# Altium project MotorControllerProject.PrjPCB
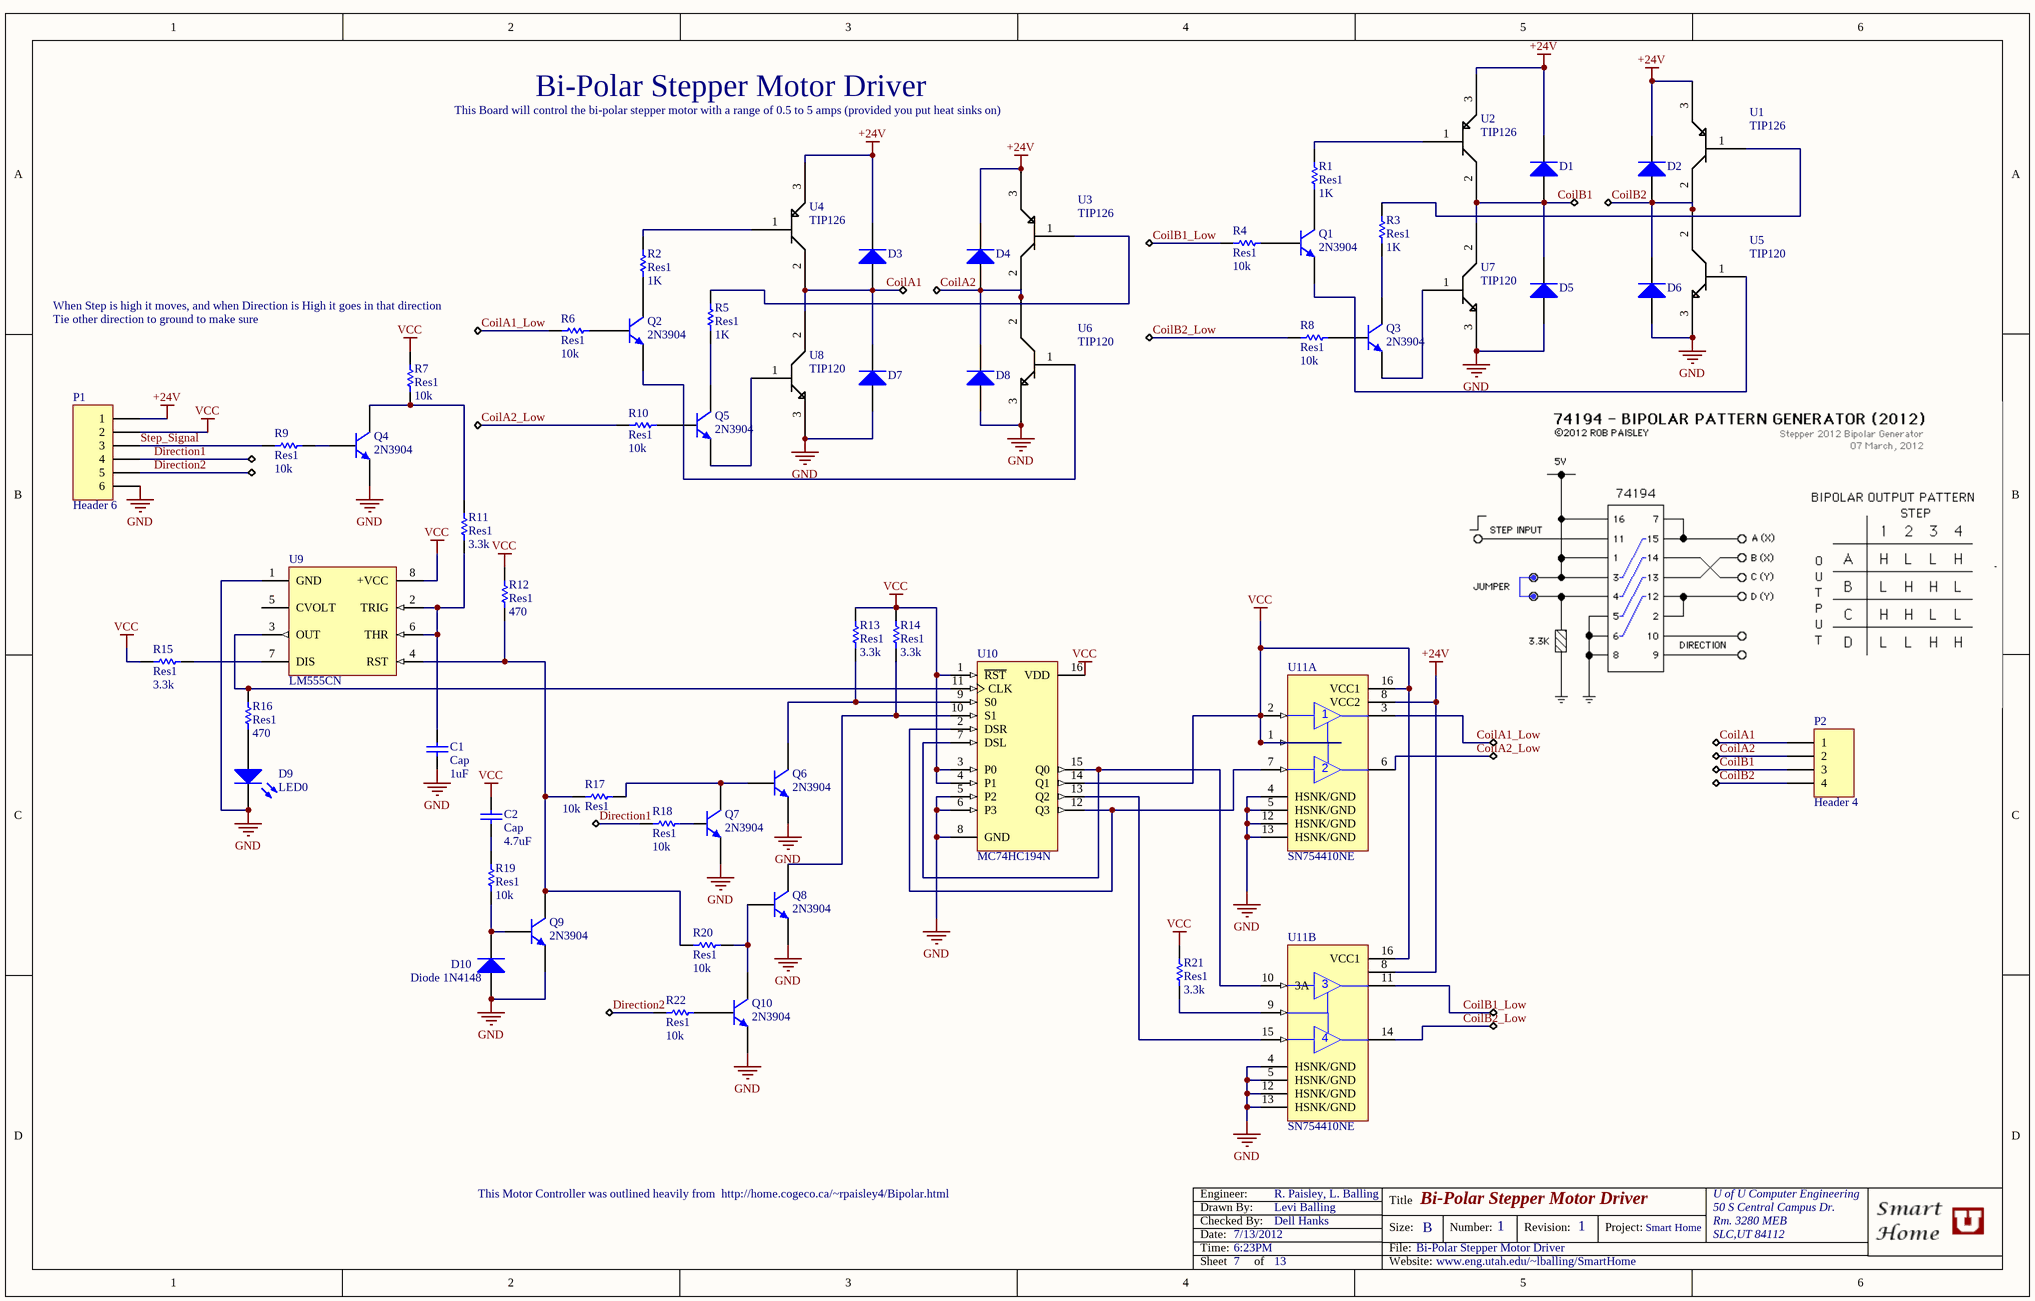
[diagram p0: MotorController.SchDoc]
1 sheet, 57 parts. Net scope: global (net labels, ports and power ports of the same name join across sheets).
Board file: HighPowerMotorController.PcbDoc

## Sheet MotorController.SchDoc: Bi-Polar Stepper Motor Driver
size B; Date: 7/13/2012; ApprovedBy: Levi Balling; CheckedBy: Dell Hanks; Author: Rob Paisley; CompanyName: Smart Home; DrawnBy: Levi Balling; Engineer: R. Paisley, L. Balling; Organization: U of U Computer Engineering; Address1: 50 S Central Campus Dr.; Address2: Rm. 3280 MEB; Address3: SLC,UT 84112; DocumentNumber: 1; Revision: 1; SheetNumber: 7; SheetTotal: 13; Project: Smart Home; Website: www.eng.utah.edu/~lballing/SmartHome; Description: This Board will control the bi-polar stepper motor with a range of 0.5 to 5 amps (provided you put heat sinks on); CurrentTime: 6:23PM; CurrentDate: 7/13/2012; DocumentName: Bi-Polar Stepper Motor Driver; ProjectName: Smart Home

### Parts
C1  Cap  value 1uF  [RAD-0.3]
C2  Cap  value 4.7uF  [RAD-0.3]
D1  Diode 1N5408  [DO-201AD]  (value not drawn)
D2  Diode 1N5408  [DO-201AD]  (value not drawn)
D3  Diode 1N5408  [DO-201AD]  (value not drawn)
D4  Diode 1N5408  [DO-201AD]  (value not drawn)
D5  Diode 1N5408  [DO-201AD]  (value not drawn)
D6  Diode 1N5408  [DO-201AD]  (value not drawn)
D7  Diode 1N5408  [DO-201AD]  (value not drawn)
D8  Diode 1N5408  [DO-201AD]  (value not drawn)
D9  LED0  [LED-0]
D10  Diode 1N4148  [DO-35]
P1  Header 6  [HDR1X6]
P2  Header 4  [HDR1X4]
Q1  2N3904  [2N3904]
Q2  2N3904  [2N3904]
Q3  2N3904  [2N3904]
Q4  2N3904  [2N3904]
Q5  2N3904  [2N3904]
Q6  2N3904  [2N3904]
Q7  2N3904  [2N3904]
Q8  2N3904  [2N3904]
Q9  2N3904  [2N3904]
Q10  2N3904  [2N3904]
R1  Res1  value 1K  [AXIAL-0.3]
R2  Res1  value 1K  [AXIAL-0.3]
R3  Res1  value 1K  [AXIAL-0.3]
R4  Res1  value 10k  [AXIAL-0.3]
R5  Res1  value 1K  [AXIAL-0.3]
R6  Res1  value 10k  [AXIAL-0.3]
R7  Res1  value 10k  [AXIAL-0.3]
R8  Res1  value 10k  [AXIAL-0.3]
R9  Res1  value 10k  [AXIAL-0.3]
R10  Res1  value 10k  [AXIAL-0.3]
R11  Res1  value 3.3k  [AXIAL-0.3]
R12  Res1  value 470  [AXIAL-0.3]
R13  Res1  value 3.3k  [AXIAL-0.3]
R14  Res1  value 3.3k  [AXIAL-0.3]
R15  Res1  value 3.3k  [AXIAL-0.3]
R16  Res1  value 470  [AXIAL-0.3]
R17  Res1  value 10k  [AXIAL-0.3]
R18  Res1  value 10k  [AXIAL-0.3]
R19  Res1  value 10k  [AXIAL-0.3]
R20  Res1  value 10k  [AXIAL-0.3]
R21  Res1  value 3.3k  [AXIAL-0.3]
R22  Res1  value 10k  [AXIAL-0.3]
U1  TIP126  [TO-220]
U2  TIP126  [TO-220]
U3  TIP126  [TO-220]
U4  TIP126  [TO-220]
U5  TIP120  [TO-220]
U6  TIP120  [TO-220]
U7  TIP120  [TO-220]
U8  TIP120  [TO-220]
U9  LM555CN  [N08E]
U10  MC74HC194N  [648-06]
U11  SN754410NE  [NE016]  (parts A,B of 2)

### Nets
+24V: D1.2(K) D2.2(K) D3.2(K) D4.2(K) P1.1 U1.3 U2.3 U3.3 U4.3 U11.8(VCC2)
GND: C1.2 D5.1(A) D6.1(A) D7.1(A) D8.1(A) D9.2(K) D10.1(A) P1.6 Q4.1(E) Q6.1(E) Q7.1(E) Q8.1(E) Q9.1(E) Q10.1(E) U5.3 U6.3 U7.3 U8.3 U9.1(GND) U10.5(P2) U10.6(P3) U10.8(GND) U11.4(HSNK/GND) U11.5(HSNK/GND) U11.12(HSNK/GND) U11.13(HSNK/GND)
VCC: C2.1 P1.2 R7.2 R12.1 R13.1 R14.1 R15.2 R21.1 U9.8(+VCC) U10.1(~{RST}) U10.3(P0) U10.4(P1) U10.14(Q1) U10.16(VDD) U11.1(1,2EN) U11.2(1A) U11.16(VCC1)
CoilA1: D3.1(A) D7.2(K) P2.1 U4.2 U8.2
CoilA1_Low: R6.1 U11.3(1Y)
CoilA2: D4.1(A) D8.2(K) P2.2 U3.2 U6.2
CoilA2_Low: R10.1 U11.6(2Y)
CoilB1: D1.1(A) D5.2(K) P2.3 U2.2 U7.2
CoilB1_Low: R4.1 U11.11(3Y)
CoilB2: D2.1(A) D6.2(K) P2.4 U1.2 U5.2
CoilB2_Low: R8.1 U11.14(4Y)
Direction1: P1.4 R18.2
Direction2: P1.5 R22.2
Step_Signal: P1.3 R9.2
NetC1_1: C1.1 R11.1 U9.2(TRIG) U9.6(THR)
NetC2_2: C2.2 R19.1
NetD9_1: D9.1(A) R16.2
NetD10_2: D10.2(K) Q9.2(B) R19.2
NetQ1_1: Q1.1(E) U5.1
NetQ1_2: Q1.2(B) R4.2
NetQ1_3: Q1.3(C) R1.1
NetQ2_1: Q2.1(E) U6.1
NetQ2_2: Q2.2(B) R6.2
NetQ2_3: Q2.3(C) R2.1
NetQ3_1: Q3.1(E) U7.1
NetQ3_2: Q3.2(B) R8.2
NetQ3_3: Q3.3(C) R3.1
NetQ4_2: Q4.2(B) R9.1
NetQ4_3: Q4.3(C) R7.1 R11.2
NetQ5_1: Q5.1(E) U8.1
NetQ5_2: Q5.2(B) R10.2
NetQ5_3: Q5.3(C) R5.1
NetQ6_2: Q6.2(B) Q7.3(C) R17.2
NetQ6_3: Q6.3(C) R13.2 U10.9(S0)
NetQ7_2: Q7.2(B) R18.1
NetQ8_2: Q8.2(B) Q10.3(C) R20.2
NetQ8_3: Q8.3(C) R14.2 U10.10(S1)
NetQ9_3: Q9.3(C) R12.2 R17.1 R20.1 U9.4(RST)
NetQ10_2: Q10.2(B) R22.1
NetR1_2: R1.2 U2.1
NetR2_2: R2.2 U4.1
NetR3_2: R3.2 U1.1
NetR5_2: R5.2 U3.1
NetR15_1: R15.1 U9.7(DIS)
NetR16_1: R16.1 U9.3(OUT) U10.11(CLK)
NetR21_2: R21.2 U11.9(3,4EN)
NetU10_2: U10.2(DSR) U10.12(Q3) U11.7(2A)
NetU10_7: U10.7(DSL) U10.15(Q0) U11.10(3A)
NetU10_13: U10.13(Q2) U11.15(4A)

Not connected (* = marked no-connect by the designer): U9 5(CVOLT)

### Notes on the sheet
- (near R6) When Step is high it moves, and when Direction is High it goes in that direction
- Tie other direction to ground to make sure
- This Motor Controller was outlined heavily from  http://home.cogeco.ca/~rpaisley4/Bipolar.html
- Date:
- Time:
- Engineer:
- Drawn By:
- Checked By:
- Title
- Size:
- File:
- B
- Number:
- Revision:
- Project:
- Sheet
- of
- Website:

### Library data of the parts
C1 C2 = Cap: Capacitor; Vendor: Taydaelectronics; Published: 8-Jun-2000; LatestRevisionDate: 17-Jul-2002; LatestRevisionNote: Re-released for DXP Platform.; PackageReference: RAD-0.3; Publisher: Altium Limited; PackageDescription: Radial Cap, Thru-Hole; 2 Leads; 0.3 in Pin Spacing; Price: 0.03
D1-D8 = Diode 1N5408: 3 Amp Medium Power Silicon Rectifier Diode; Vendor: Taydaelectronics; Published: 8-Jun-2000; LatestRevisionDate: 17-Jul-2002; LatestRevisionNote: Re-released for DXP Platform.; DatasheetVersion: Aug-1984; PackageReference: DO-201AD; Publisher: Altium Limited; PackageDescription: Diode, Axial; Body 9.5 x 5.3 mm (LxDia. max), Lead Dia. 1.32 mm (max); ComponentLink1URL: http://www.irf.com/; Price: 0.03; Value: Diode 1N5408
D9 = LED0: Typical INFRARED GaAs LED; Vendor: Taydaelectronics; Published: 8-Jun-2000; LatestRevisionDate: 08-Jul-2005; LatestRevisionNote: Mech Layer 1 removed.; PackageReference: LED-0; Publisher: Altium Limited; PackageDescription: LED; 2 Leads; Price: 0.04; Value: LED0
D10 = Diode 1N4148: High Conductance Fast Diode; Vendor: Taydaelectronics; Published: 8-Jun-2000; LatestRevisionDate: 17-Jul-2002; LatestRevisionNote: Re-released for DXP Platform.; DatasheetVersion: 1997; PackageReference: DO-35; Publisher: Altium Limited; PackageDescription: Diode, Axial; Body 3.8 x 1.9 mm (LxDia. max), Lead Dia. 0.53 mm (max); Code_JEDEC: DO-204-AH; ComponentLink1URL: http://www.fairchildsemi.com/; ComponentLink2Description: Datasheet; ComponentLink2URL: http://www.fairchildsemi.com/ds/1N%2F1N4148.pdf; Price: 0.01; Value: Diode 1N4148
P1 = Header 6: Header, 6-Pin; Vendor: Taydaelectronics; LatestRevisionDate: 17-Jul-2002; LatestRevisionNote: Re-released for DXP Platform.; Publisher: Altium Limited; Price: 0.06; Value: Header 6
P2 = Header 4: Header, 4-Pin; Vendor: Taydaelectronics; LatestRevisionDate: 17-Jul-2002; LatestRevisionNote: Re-released for DXP Platform.; Publisher: Altium Limited; Price: 0.04; Value: Header 4
Q1-Q10 = 2N3904: NPN General Purpose Amplifier; Vendor: Taydaelectronics; Published: 8-Jun-2000; LatestRevisionDate: 15-Jan-2003; LatestRevisionNote: PCB Footprint 'BCY-W3/D4.7' replaced; DatasheetVersion: 1997; PackageVersion: Sep-1998; PackageReference: TO-92A; Publisher: Altium Limited; PackageDescription: TO, Flat Index; 3 In-Line, Axial Leads; Body Dia. 4.5mm; Leads 0.51 x 0.48 mm (max); ComponentLink1URL: http://www.fairchildsemi.com/; ComponentLink2Description: Datasheet; ComponentLink2URL: http://www.fairchildsemi.com/ds/2N%2F2N3904.pdf; Price: 0.01; Value: 2N3904
R1-R22 = Res1: Resistor; Vendor: Taydaelectronics; Published: 8-Jun-2000; LatestRevisionDate: 17-Jul-2002; LatestRevisionNote: Re-released for DXP Platform.; PackageReference: AXIAL-0.3; Publisher: Altium Limited; PackageDescription: Axial Device, Thru-Hole; 2 Leads; 0.3 in Pin Spacing; Price: 0.01
U1-U4 = TIP126: TIP126 -PNP; Vendor: Taydaelectronics; Price: 0.35; Value: TIP126
U5-U8 = TIP120: NPN 60V -5A TO-220; Vendor: Taydaelectronics; Price: 0.26; Value: TIP120
U9 = LM555CN: Timer; Manufacturer: National Semiconductor; CompType: Analog IC; PackageTopMarking: NSUZXYTT*LM*555CN; PowerWise: N; Vendor: Taydaelectronics; Published: 4-Dec-2008; DatasheetVersion: Jul-2006; PackageVersion: revG, May-2006; PackageReference: N08E; Publisher: Altium Limited; PackageDescription: MDIP, .365 x .250 x .130in, 8 Lead, .100in Pitch; PartNumber: LM555CN; PinCount: 8; DigiKeyPartNumber: LM555CNNS-ND; Code_JEDEC: MS-001-BA; ComponentLink1URL: http://www.national.com/ds.cgi/LM/LM555.pdf; ComponentLink2Description: LM555 Web Page; ComponentLink2URL: http://www.national.com/pf/LM/LM555.html; ComponentLink3Description: N08E package page; ComponentLink3URL: http://www.national.com/packaging/folders/n08e.html; Price: 0.14; Value: LM555CN
U10 = MC74HC194N: 4-Bit Bidirectional Universal Shift Register; Vendor: Digi-Key; Published: 17-Jul-2002; LatestRevisionDate: 06-Jun-2005; LatestRevisionNote: Stylized 3D Model Added; DatasheetVersion: 1989; PackageReference: 648-06; Publisher: Altium Limited; PackageDescription: DIP; 16 Leads; Row Spacing 7.62 mm; Pitch 2.54 mm; ComponentLink1URL: http://www.onsemi.com/site/products/parametrics/0,4446,557,00.html; Price: 0.68; Value: MC74HC194N
U11 = SN754410NE: Quadruple Half-H Driver; Vendor: U of U; Published: 15-May-2002; LatestRevisionDate: 29-May-2009; LatestRevisionNote: Component Body Added.; DatasheetVersion: May-1990; PackageVersion: 1991; PackageReference: NE016; Publisher: Altium Limited; PackageDescription: DIP, 16-Pin, Row Spacing 7.62 mm, Pitch 2.54 mm; Code_JEDEC: MS-001-BB; ComponentLink1URL: http://www.ti.com/; ComponentLink2Description: Datasheet; ComponentLink2URL: http://www-s.ti.com/sc/ds/sn754410.pdf; Price: 0.00; Value: SN754410NE